# EAGLE design Rev2 (EAGLE 4.16)
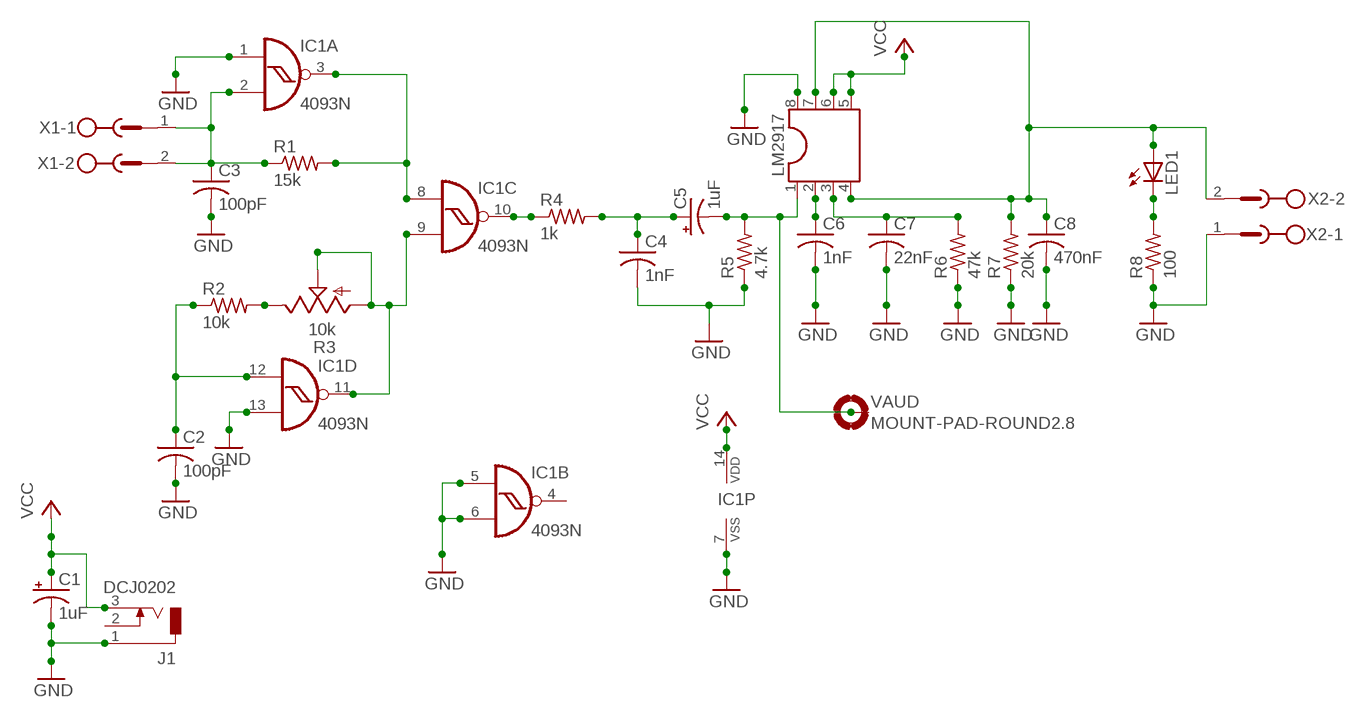
[diagram p0: schematic, sheet 1]

## Parts
C1  1uF  CPOL-USE3.5-10  [E3,5-10]
C2  100pF  C-US050-030X075  [C050-030X075]
C3  100pF  C-US050-030X075  [C050-030X075]
C4  1nF  C-US050-030X075  [C050-030X075]
C5  1uF  CPOL-USE3.5-10  [E3,5-10]
C6  1nF  C-US050-030X075  [C050-030X075]
C7  22nF  C-US050-030X075  [C050-030X075]
C8  470nF  C-US050-030X075  [C050-030X075]
IC1  4093N  [DIL14]
J1  DCJ0202  [DCJ0202]
LED1  LED5MM  [LED5MM]
LM2917  DIL8  [DIL08]
R1  15k  R-US_0414/15  [0414/15]
R2  10k  R-US_0414/15  [0414/15]
R3  10k  TRIM_US-B25P  [B25P]
R4  1k  R-US_0414/15  [0414/15]
R5  4.7k  R-US_0414/15  [0414/15]
R6  47k  R-US_0414/15  [0414/15]
R7  20k  R-US_0414/15  [0414/15]
R8  100  R-US_0414/15  [0414/15]
VAUD  MOUNT-PAD-ROUND2.8  [2,8-PAD]
X1  MSTBV2  [MSTBV2]
X2  MSTBV2  [MSTBV2]

## Nets
GND: C1.- C2.2 C3.2 C4.2 C6.2 C7.2 C8.2 IC1.1(A:I0) IC1.5(B:I0) IC1.6(B:I1) IC1.7(P:VSS) IC1.13(D:I1) J1.1 LM2917.8 R5.1 R6.1 R7.1 R8.1 X2.1
N$1: R2.2 R3.E
N$2: IC1.3(A:O) IC1.8(C:I0) R1.2
N$3: C3.1 IC1.2(A:I1) R1.1 X1.1 X1.2
N$4: C2.1 IC1.12(D:I0) R2.1
N$5: C6.1 LM2917.2
N$6: C8.1 LED1.A LM2917.4 LM2917.7 R7.2 X2.2
N$7: IC1.10(C:O) R4.1
N$10: C5.- LM2917.1 R5.2 VAUD.B2,8(MOUNT)
N$12: C7.1 LM2917.3 R6.2
N$14: C4.1 C5.+ R4.2
N$16: LED1.K(C) R8.2
N$17: IC1.9(C:I1) IC1.11(D:O) R3.A R3.S
VCC: C1.+ IC1.14(P:VDD) J1.3 LM2917.5 LM2917.6
Unconnected: IC1.4(B:O) J1.2

## Library data of the parts
C1 C5 = rcl:CPOL-US: POLARIZED CAPACITOR, American symbol
C2-C4 C6-C8 = rcl:C-US: CAPACITOR, American symbol
IC1 = 40xx:4093: Quad 2-input NAND schmitt trigger
J1 = con-jack:DCJ0202: DC POWER JACK Source: DCJ0202.pdf
LED1 = led:LED: LED OSRAM: - CHIPLED LG R971, LG N971, LY N971, LG Q971, LY Q971, LO R971, LY R971 LH N974, LH R974 LS Q976, LO Q976, LY Q976 LO Q996 - Hyper CHIPLED LW Q18S LB Q993, LB Q99A, LB R99A - SideLED LS A670, LO A670, LY A670, LG A670, LP A670 LB A673, LV A673, LT A673, LW A673 LH A674 LY A675 LS A676, LA A676, LO A676, LY A676, LW A676 LS A679, LY A679, LG A679 - Hyper Micro SIDELED® LS Y876, LA Y876, LO Y876, LY Y876 LT Y87S - SmartLED LW L88C, LW L88S LB L89C, LB L89S, LG L890 LS L89K, LO L89K, LY L89K LS L896, LA L896, LO L896, LY L896 - TOPLED LS T670, LO T670, LY T670, LG T670, LP T670 LSG T670, LSP T670, LSY T670, LOP T670, LYG T670 LG T671, LOG T671, LSG T671 LB T673, LV T673, LT T673, LW T673 LH T674 LS T676, LA T676, LO T676, LY T676, LB T676, LH T676, LSB T676, LW T676 LB T67C, LV T67C, LT T67C, LS T67K, LO T67K, LY T67K, LW E67C LS E67B, LA E67B, LO E67B, LY E67B, LB E67C, LV E67C, LT E67C LW T67C LS T679, LY T679, LG T679 LS T770, LO T770, LY T770, LG T770, LP T770 LB T773, LV T773, LT T773, LW T773 LH T774 LS E675, LA E675, LY E675, LS T675 LS T776, LA T776, LO T776, LY T776, LB T776 LHGB T686 LT T68C, LB T68C - Hyper Mini TOPLED® LB M676 - Mini TOPLED Santana® LG M470 LS M47K, LO M47K, LY M47K Source: http://www.osram.convergy.de - LUMILED® LXK2-PW12-R00, LXK2-PW12-S00, LXK2-PW14-U00, LXK2-PW14-V00 LXK2-PM12-R00, LXK2-PM12-S00, LXK2-PM14-U00 LXK2-PE12-Q00, LXK2-PE12-R00, LXK2-PE12-S00, LXK2-PE14-T00, LXK2-PE14-U00 LXK2-PB12-K00, LXK2-PB12-L00, LXK2-PB12-M00, LXK2-PB14-N00, LXK2-PB14-P00, LXK2-PB14-Q00 LXK2-PR12-L00, LXK2-PR12-M00, LXK2-PR14-Q00, LXK2-PR14-R00 LXK2-PD12-Q00, LXK2-PD12-R00, LXK2-PD12-S00 LXK2-PH12-R00, LXK2-PH12-S00 LXK2-PL12-P00, LXK2-PL12-Q00, LXK2-PL12-R00 Source: www.luxeon.com
LM2917 = ic-package:DIL8: Dual In Line
R1 R2 R4-R8 = rcl:R-US_: RESISTOR, American symbol
R3 = pot:TRIM_US-: POTENTIOMETER
VAUD = holes:MOUNT-PAD-ROUND: MOUNTING PAD, round
X1 X2 = con-phoenix-500:MSTBV2: PHOENIX

## Board
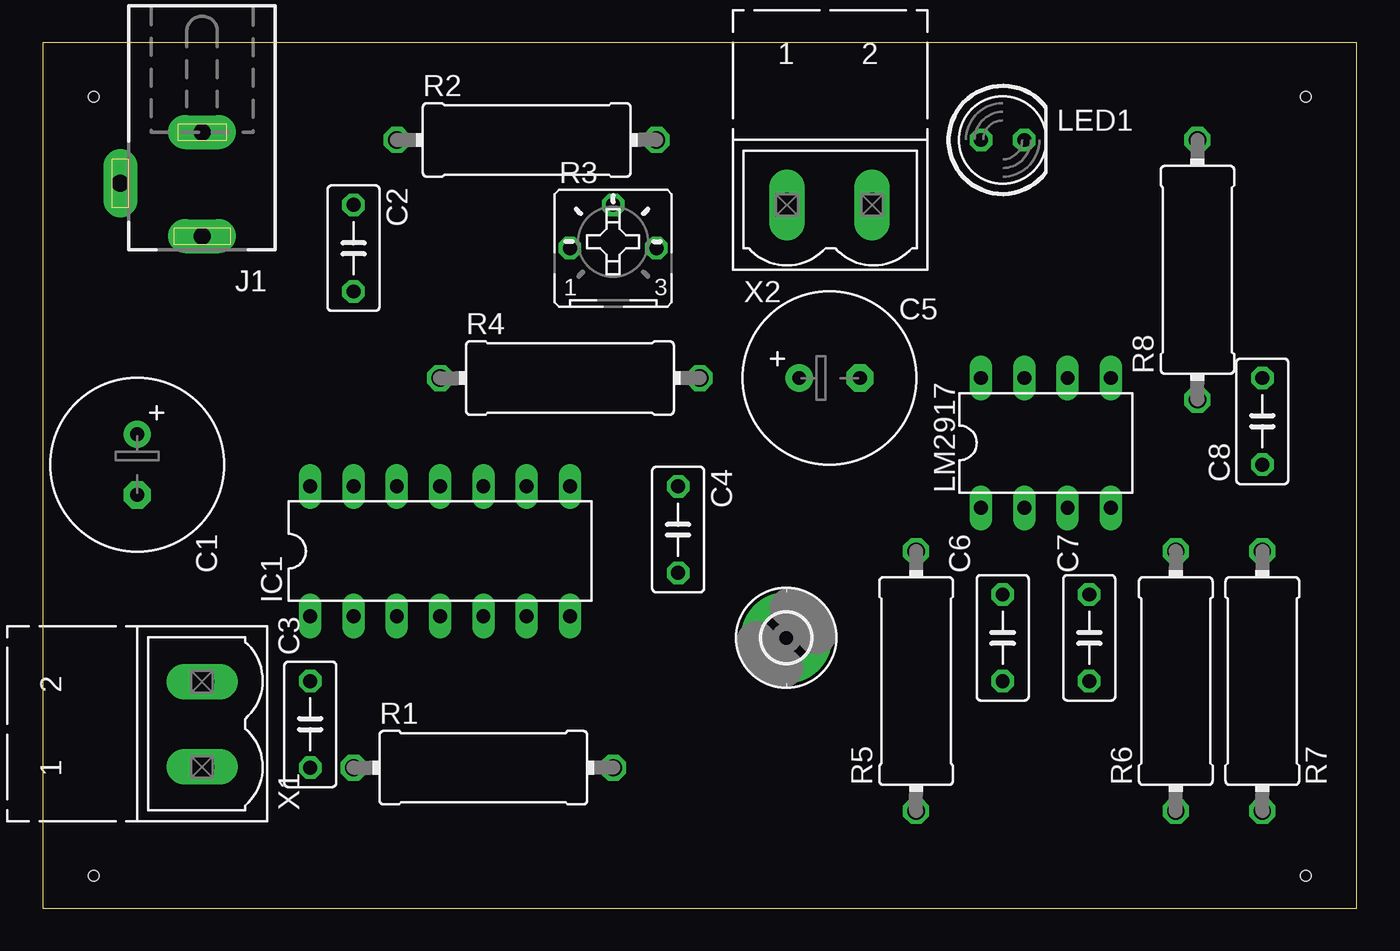
[diagram p1: board, top side]
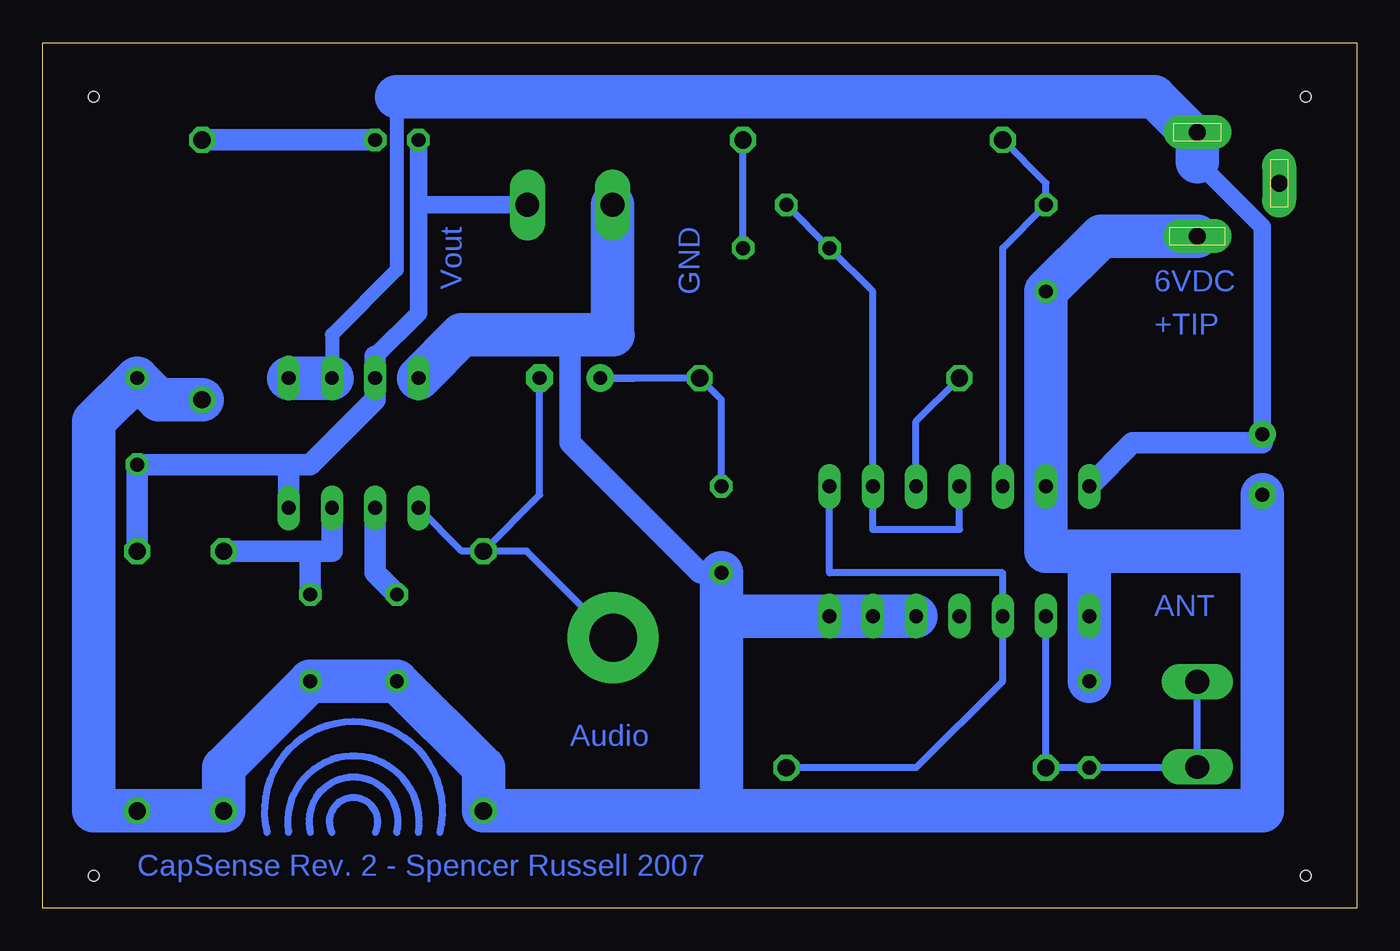
[diagram p2: board, bottom side, seen from below]

Size 77.14 x 50.79 mm. Coordinates in mm from the lower left corner, seen from the top.
Outline: 0,0 77.14,0 77.14,50.79 0,50.79 0,0
Copper layers (1*16): Top 0.035mm / dielectric 1.5mm / Bottom 0.035mm
Design rules "default": minimum track width 10mil, minimum drill 24mil, track to track 8mil, track to pad 8mil, pad to pad 8mil, via to via 8mil, smd to smd 8mil, copper to edge 40mil, drill to drill 8mil, minimum pad ring 10mil, minimum via ring 8mil, stop-mask expansion 4mil, vias tented up to drill 0mil, thermal gap 10mil
Holes 0.6 mm at 3.01,47.62 3.01,1.9 74.13,1.9 74.13,47.62

### Footprints (pad centres in the part's own frame; a part is rotated, then mirrored left to right if it is on the bottom)
E3,5-10 = drill 0.813 pad 1.6 round: + -1.778,0 | drill 0.813 pad 1.6 octagon: - 1.778,0
C050-030X075 = drill 0.813 octagon: 1 -2.54,0; 2 2.54,0
DIL14 = drill 0.813 long: 1 -7.62,-3.81; 2 -5.08,-3.81; 3 -2.54,-3.81; 4 0,-3.81; 5 2.54,-3.81; 6 5.08,-3.81; 7 7.62,-3.81; 8 7.62,3.81; 9 5.08,3.81; 10 2.54,3.81; 11 0,3.81; 12 -2.54,3.81; 13 -5.08,3.81; 14 -7.62,3.81
DCJ0202 = drill 1 pad 2 long: 1 0,3.1; 2 4.8,0; 3 0,-3
LED5MM = drill 0.813 octagon: A -1.27,0; K 1.27,0
DIL08 = drill 0.813 long: 1 -3.81,-3.81; 2 -1.27,-3.81; 3 1.27,-3.81; 4 3.81,-3.81; 5 3.81,3.81; 6 1.27,3.81; 7 -1.27,3.81; 8 -3.81,3.81
0414/15 = drill 1.016 octagon: 1 -7.62,0; 2 7.62,0
B25P = drill 0.813 octagon: A -2.54,0; E 2.54,0; S 0,2.54
2,8-PAD = drill 2.8 pad 5.334 round: B2,8 0,0
MSTBV2 = drill 1.397 long: 1 -2.5,0; 2 2.5,0

### Placement (x,y rotation side)
C1  5.55,26.03 270 top
C2  18.25,38.73 270 top
C3  15.71,10.79 90 top
C4  37.3,22.22 270 top
C5  46.19,31.11 0 top
C6  56.35,15.87 270 top
C7  61.43,15.87 270 top
C8  71.59,28.57 90 top
IC1  23.33,20.95 0 top
J1  9.36,42.54 180 top
LED1  56.35,45.08 0 top
LM2917  58.89,27.3 0 top
R1  25.87,8.25 0 top
R2  28.41,45.08 0 top
R3  33.49,38.73 0 top
R4  30.95,31.11 0 top
R5  51.27,13.33 90 top
R6  66.51,13.33 90 top
R7  71.59,13.33 90 top
R8  67.78,37.46 90 top
VAUD  43.65,15.87 0 top
X1  9.36,10.79 90 top
X2  46.19,41.27 0 top

### Tracks (layer width: path | path; a pad name or v marks a point on that pad's centre or on a via)
GND
  Bottom 1.27: 43.65,33.65 43.69,33.69 | C4.2 38.57,19.68 46.19,27.3 46.19,33.65
  Bottom 2.54: J1.1 15,39.44 C2.2 IC1.13 18.25,20.95 15.71,20.95 | 37.3,17.14 C4.2 | 37.3,17.14 IC1.7 IC1.6 IC1.5 | C3.2 IC1.1 15.71,20.95 | 5.55,20.95 5.55,5.71 37.3,5.71 | 5.55,20.95 C1.- | 5.55,20.95 15.71,20.95 | 37.3,5.71 37.3,17.14 | 37.3,5.71 R5.1 51.27,8.25 C6.2 C7.2 66.51,8.25 R6.1 R7.1 74.13,5.71 74.13,28.57 C8.2 70.32,29.84 R8.1 | 43.65,33.65 46.19,33.65 52.54,33.65 LM2917.8 | 43.69,33.69 X2.1
N$1
  Bottom 0.406: R3.E R2.2
N$2
  Bottom 0.406: IC1.8 30.95,19.68 20.79,19.68 IC1.3 20.79,13.33 25.87,8.25 R1.2
N$3
  Bottom 0.406: IC1.2 R1.1 C3.1 9.4,8.25 X1.1 X1.2 9.36,13.33
N$4
  Bottom 0.406: R2.1 18.25,42.54 C2.1 20.79,38.73 IC1.12
N$5
  Bottom 1.27: LM2917.2 57.62,19.68 C6.1
N$6
  Bottom 1.016: 57.62,32.38 55.08,34.92 55.08,41.27 | 55.08,41.27 LED1.A | 55.08,41.27 X2.2
  Bottom 1.27: R7.2 C8.1 62.7,26.03 | LM2917.4 62.7,26.03 | 62.7,26.03 61.43,26.03 57.62,29.84 LM2917.7 57.62,32.38
N$7
  Bottom 0.406: IC1.10 25.87,28.57 R4.1
N$10
  Bottom 0.406: LM2917.1 52.54,20.95 R5.2 | R5.2 48.73,20.95 VAUD.B2,8 | C5.- 47.97,24.25 R5.2
N$12
  Bottom 1.27: 61.43,20.95 60.16,20.95 LM2917.3 | 61.43,20.95 R6.2 | C7.1 61.43,20.95
N$14
  Bottom 0.406: 42.38,31.11 C5.+ R4.2 37.3,29.84 C4.1
N$16
  Bottom 1.27: LED1.K R8.2
N$17
  Bottom 0.406: R3.S R3.A 28.41,36.19 IC1.9 28.41,22.22 23.33,22.22 IC1.11
N$18
  Bottom 0.406: 53.81,4.44 arc-208 63.97,4.44
N$22
  Bottom 0.406: 55.08,4.44 arc-199 62.7,4.44
N$23
  Bottom 0.406: 56.35,4.44 arc-208 61.43,4.44
N$24
  Bottom 0.406: 57.62,4.44 arc-233 60.16,4.44
VCC
  Bottom 0.406: 9.36,45.08 J1.3
  Bottom 0.813: C1.+ 5.55,27.3 | 56.35,47.62 56.35,37.46 60.16,33.65 LM2917.6
  Bottom 1.016: 9.36,43.81 5.55,40 5.55,27.3
  Bottom 1.27: 5.55,27.3 13.17,27.3 IC1.14
  Bottom 2.54: LM2917.6 LM2917.5 | 9.36,43.81 9.36,45.08 11.9,47.62 56.35,47.62

### Text on the board
Bottom: GND | Vout | 6VDC | +TIP | ANT | Audio | CapSense Rev. 2 - Spencer Russell 2007